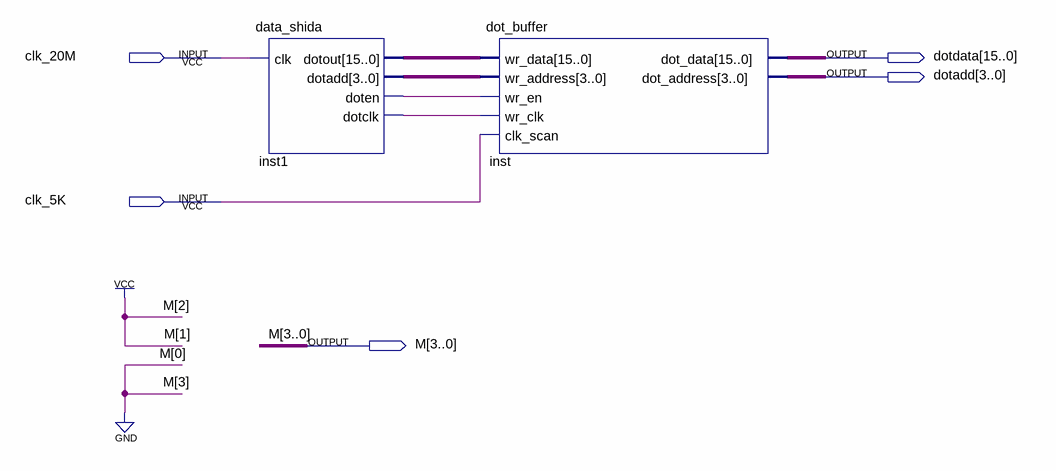
[diagram p0: schematic sheet]
// Quartus schematic DIANZHENDRIVER.bdf as structural Verilog: 2 symbols, 5 pins
module DIANZHENDRIVER (
  input  clk_20M,
  input  clk_5K,
  output [15:0] dotdata,
  output [3:0] dotadd,
  output [3:0] M
);

  wire inst1_dotclk, inst1_doten;
  wire [3:0] inst1_dotadd;
  wire [15:0] inst1_dotout;

  data_shida inst1 (
    .clk(clk_20M), .dotout(inst1_dotout), .dotadd(inst1_dotadd), .doten(inst1_doten), .dotclk(inst1_dotclk));
  dot_buffer inst (
    .wr_data(inst1_dotout), .wr_address(inst1_dotadd), .wr_en(inst1_doten), .wr_clk(inst1_dotclk),
    .clk_scan(clk_5K), .dot_data(dotdata), .dot_address(dotadd));

  assign M = 4'b0110;
endmodule
